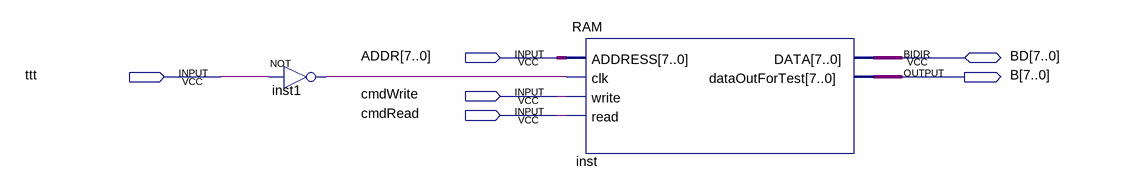
[diagram p0: schematic sheet]
// Quartus schematic ttt.bdf as structural Verilog: 2 symbols, 6 pins
module ttt (
  input  [7:0] ADDR,
  input  ttt,
  input  cmdWrite,
  input  cmdRead,
  inout  [7:0] BD,
  output [7:0] B
);

  wire inst1_out;

  not inst1 (inst1_out, ttt);
  RAM inst (.ADDRESS(ADDR), .clk(inst1_out), .write(cmdWrite), .read(cmdRead), .dataOutForTest(B), .DATA(BD));
endmodule
